# EAGLE design blade design (EAGLE 9.0.0)
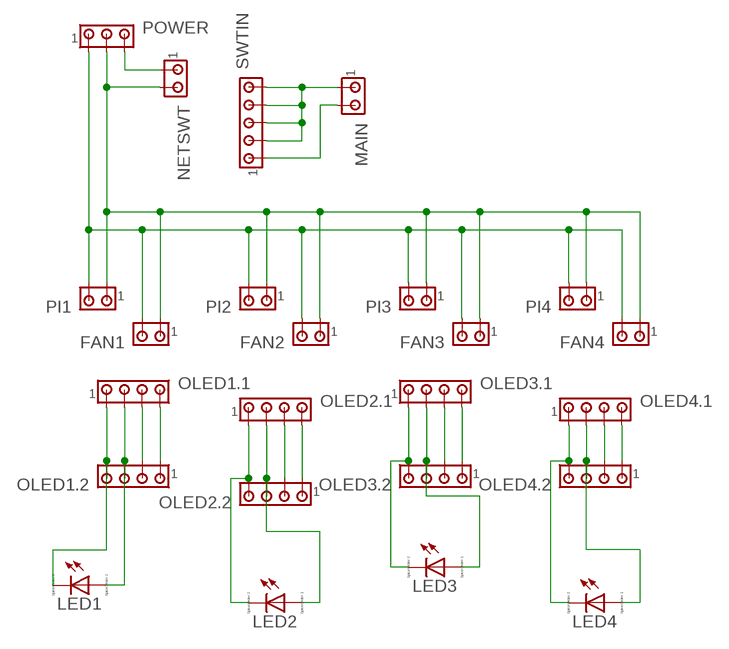
[diagram p0: schematic, sheet 1]

## Parts
FAN1  MTA02-156  [1X2MTA]
FAN2  MTA02-156  [1X2MTA]
FAN3  MTA02-156  [1X2MTA]
FAN4  MTA02-156  [1X2MTA]
LED1  LED_ELD260  [LED_LD260]
LED2  LED_ELD260  [LED_LD260]
LED3  LED_ELD260  [LED_LD260]
LED4  LED_ELD260  [LED_LD260]
MAIN  MTA02-156  [1X2MTA]
NETSWT  MTA02-156  [1X2MTA]
OLED1.1  MTA04-156  [1X4MTA]
OLED1.2  MTA04-156  [1X4MTA]
OLED2.1  MTA04-156  [1X4MTA]
OLED2.2  MTA04-156  [1X4MTA]
OLED3.1  MTA04-156  [1X4MTA]
OLED3.2  MTA04-156  [1X4MTA]
OLED4.1  MTA04-156  [1X4MTA]
OLED4.2  MTA04-156  [1X4MTA]
PI1  MTA02-156  [1X2MTA]
PI2  MTA02-156  [1X2MTA]
PI3  MTA02-156  [1X2MTA]
PI4  MTA02-156  [1X2MTA]
POWER  MTA03-156  [1X3MTA]
SWTIN  MTA05-156  [1X5MTA]

## Nets
3.3V: MAIN.2 SWTIN.1
5V: FAN1.2 FAN2.2 FAN3.2 FAN4.2 PI1.2 PI2.2 PI3.2 PI4.2 POWER.1
12V: NETSWT.1 POWER.3
GND: FAN1.1 FAN2.1 FAN3.1 FAN4.1 NETSWT.2 PI1.1 PI2.1 PI3.1 PI4.1 POWER.2
GND1: LED1.K(C) OLED1.1.1 OLED1.2.4
GND2: LED2.K(C) OLED2.1.1 OLED2.2.4
GND3: LED3.K(C) OLED3.1.1 OLED3.2.4
GND4: LED4.K(C) OLED4.1.1 OLED4.2.4
SCL1: OLED1.1.3 OLED1.2.2
SCL2: OLED2.1.3 OLED2.2.2
SCL3: OLED3.1.3 OLED3.2.2
SCL4: OLED4.1.3 OLED4.2.2
SDA1: OLED1.1.4 OLED1.2.1
SDA2: OLED2.1.4 OLED2.2.1
SDA3: OLED3.1.4 OLED3.2.1
SDA4: OLED4.1.4 OLED4.2.1
SWTCH: MAIN.1 SWTIN.2 SWTIN.3 SWTIN.4 SWTIN.5
VCC1: LED1.A OLED1.1.2 OLED1.2.3
VCC2: LED2.A OLED2.1.2 OLED2.2.3
VCC3: LED3.A OLED3.1.2 OLED3.2.3
VCC4: LED4.A OLED4.1.2 OLED4.2.3

## Library data of the parts
FAN1-FAN4 MAIN NETSWT PI1-PI4 = con-amp:MTA02-156: AMP connector
LED1-LED4 = eagle-ltspice:LED_E: LED Source: http://www.osram.convergy.de Source: www.luxeon.com Source: www.kingbright.com; SPICEMODEL: NONE; SPICEPREFIX: D; SPICETYPE: diode
OLED1.1 OLED1.2 OLED2.1 OLED2.2 OLED3.1 OLED3.2 OLED4.1 OLED4.2 = con-amp:MTA04-156: AMP connector
POWER = con-amp:MTA03-156: AMP connector
SWTIN = con-amp:MTA05-156: AMP connector

## Board
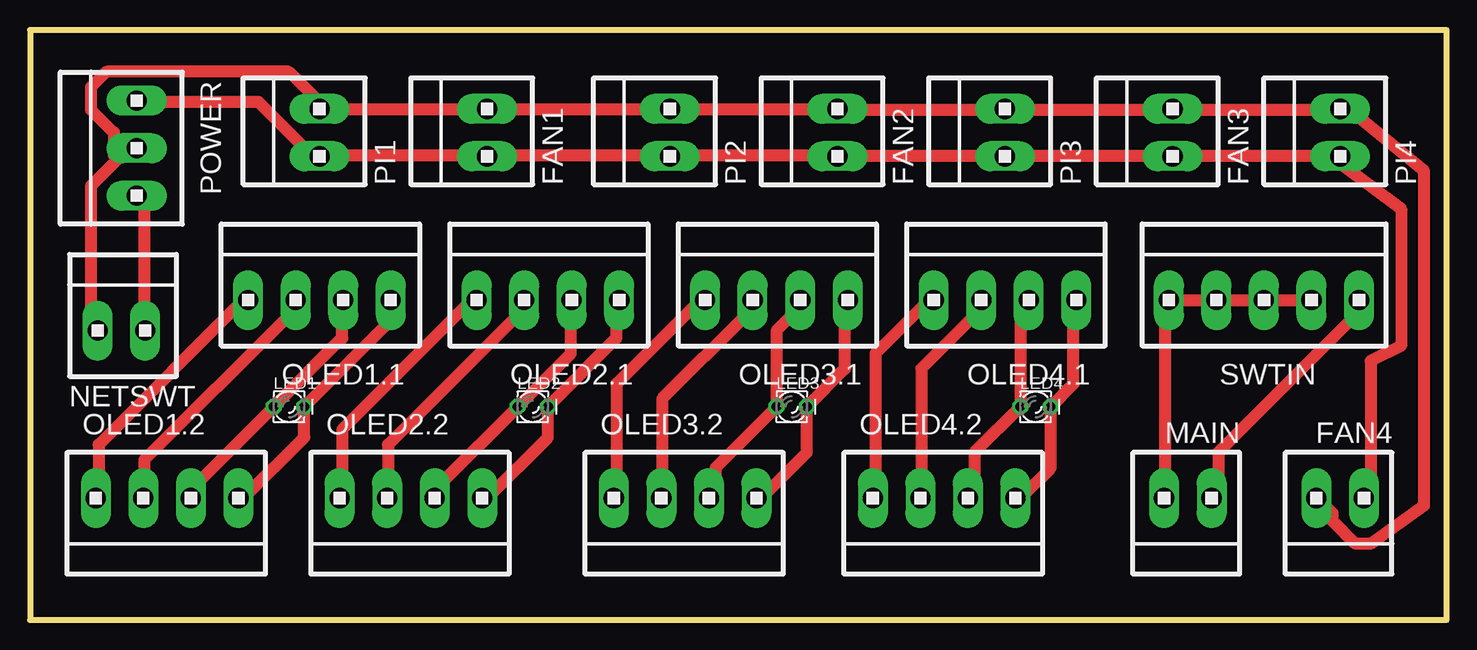
[diagram p1: board, top side]

Size 118.09 x 49.2 mm. Coordinates in mm from the lower left corner, seen from the top.
Outline: 0,0 118.09,0 118.09,49.2 0,49.2 0,0
Copper layers (1*16): Top 0.035mm / dielectric 1.5mm / Bottom 0.035mm
Design rules "default *": minimum track width 40mil, minimum drill 24mm, track to track 16mil, track to pad 16mil, pad to pad 16mil, via to via 16mil, smd to smd 16mil, copper to edge 30mil, drill to drill 8mil, minimum pad ring 10mil, minimum via ring 8mil, stop-mask expansion 4mil, vias tented up to drill 0mil, thermal gap 10mil

### Footprints (pad centres in the part's own frame; a part is rotated, then mirrored left to right if it is on the bottom)
1X2MTA = drill 1.676 long: 1 1.981,0; 2 -1.981,0
LED_LD260 = drill 0.813 octagon: A -1.27,0; K 1.27,0
1X4MTA = drill 1.676 long: 1 5.944,0; 2 1.981,0; 3 -1.981,0; 4 -5.944,0
1X3MTA = drill 1.676 long: 1 3.937,0; 2 -0.025,0; 3 -3.988,0
1X5MTA = drill 1.676 long: 1 7.925,0; 2 3.962,0; 3 0,0; 4 -3.962,0; 5 -7.925,0

### Placement (x,y rotation side)
FAN1  38.1,40.64 90 top
FAN2  67.31,40.64 90 top
FAN3  95.25,40.64 90 top
FAN4  109.22,10.16 180 top
LED1  21.59,17.78 0 top
LED2  41.91,17.78 0 top
LED3  63.5,17.78 0 top
LED4  83.82,17.78 0 top
MAIN  96.52,10.16 180 top
NETSWT  7.62,24.13 0 top
OLED1.1  24.13,26.67 0 top
OLED1.2  11.43,10.16 180 top
OLED2.1  43.18,26.67 0 top
OLED2.2  31.75,10.16 180 top
OLED3.1  62.23,26.67 0 top
OLED3.2  54.61,10.16 180 top
OLED4.1  81.28,26.67 0 top
OLED4.2  76.2,10.16 180 top
PI1  24.13,40.64 90 top
PI2  53.34,40.64 90 top
PI3  81.28,40.64 90 top
PI4  109.22,40.64 90 top
POWER  8.89,39.37 90 top
SWTIN  102.87,26.67 0 top

### Tracks (layer width: path | path; a pad name or v marks a point on that pad's centre or on a via)
3.3V
  Top 1.016: MAIN.2 99.06,10.16 99.06,13.97 110.49,25.4 110.49,26.67 SWTIN.1
5V
  Top 1.016: 38.1,38.73 24.13,38.73 PI1.2 24.13,38.1 19.05,43.18 8.89,43.18 POWER.1 | 67.31,38.73 53.34,38.73 | 67.31,38.73 81.28,38.73 | 67.31,38.73 FAN2.2 | 81.28,38.73 95.25,38.73 | 81.28,38.73 PI3.2 | 95.25,38.73 109.22,38.73 PI4.2 109.22,38.1 114.3,34.29 114.3,22.86 111.76,21.59 111.76,10.16 FAN4.2 | 95.25,38.73 FAN3.2 | 53.34,38.73 38.1,38.73 | 38.1,38.73 FAN1.2 | 53.34,38.73 PI2.2
12V
  Top 1.016: NETSWT.1 9.52,24.13 9.52,34.29 8.89,34.92 POWER.3
GND
  Top 1.016: FAN4.1 107.31,10.16 108.58,8.89 108.58,8.26 110.49,6.35 111.76,6.35 116.2,9.53 116.2,37.47 109.22,43.18 PI4.1 109.22,42.55 95.25,42.55 | NETSWT.2 5.08,24.13 5.08,36.2 7.62,38.73 8.89,38.73 POWER.2 6.99,38.73 6.99,40.64 5.08,42.55 5.08,44.45 6.35,45.72 21.59,45.72 24.13,43.18 PI1.1 24.13,42.55 38.1,42.55 | 67.31,42.55 53.34,42.55 | 67.31,42.55 81.28,42.55 | 67.31,42.55 FAN2.1 | 81.28,42.55 95.25,42.55 | 81.28,42.55 PI3.1 | 53.34,42.55 38.1,42.55 | 38.1,42.55 FAN1.1 | 53.34,42.55 PI2.1 | 95.25,42.55 FAN3.1
GND1
  Top 1.016: OLED1.2.4 17.78,10.16 22.86,15.24 LED1.K 29.84,24.77 29.84,26.67 OLED1.1.1
GND2
  Top 1.016: OLED2.2.4 38.1,10.16 43.18,15.24 LED2.K 48.9,23.5 48.9,26.67 OLED2.1.1
GND3
  Top 1.016: OLED3.2.4 60.96,10.16 64.77,13.97 LED3.K 67.94,20.95 67.94,26.67 OLED3.1.1
GND4
  Top 1.016: OLED4.2.4 82.55,10.16 85.09,12.7 LED4.K 86.99,19.68 86.99,26.67 OLED4.1.1
SCL1
  Top 1.016: OLED1.2.2 9.52,10.16 9.52,13.34 21.59,25.4 21.59,26.67 OLED1.1.3
SCL2
  Top 1.016: OLED2.2.2 29.84,10.16 29.84,14.61 40.64,25.4 40.64,26.67 OLED2.1.3
SCL3
  Top 1.016: OLED3.2.2 52.7,10.16 52.7,18.41 59.69,25.4 59.69,26.67 OLED3.1.3
SCL4
  Top 1.016: OLED4.2.2 74.29,10.16 74.29,20.95 78.74,25.4 78.74,26.67 OLED4.1.3
SDA1
  Top 1.016: OLED1.2.1 5.72,10.16 5.72,14.61 17.78,26.67 OLED1.1.4
SDA2
  Top 1.016: OLED2.2.1 26.04,10.16 26.04,15.88 36.83,26.67 OLED2.1.4
SDA3
  Top 1.016: OLED3.2.1 48.9,10.16 48.9,19.68 55.88,26.67 OLED3.1.4
SDA4
  Top 1.016: OLED4.2.1 70.48,10.16 70.48,22.23 74.93,26.67 OLED4.1.4
SWTCH
  Top 1.016: MAIN.1 94.61,10.16 94.61,26.67 SWTIN.5 SWTIN.4 SWTIN.3 SWTIN.2
VCC1
  Top 1.016: OLED1.2.3 13.97,10.16 13.97,11.43 LED1.A 26.04,23.5 26.04,26.67 OLED1.1.2
VCC2
  Top 1.016: OLED2.2.3 34.29,10.16 34.29,11.43 LED2.A 45.09,22.23 45.09,26.67 OLED2.1.2
VCC3
  Top 1.016: OLED3.1.2 64.77,26.67 62.23,24.13 LED3.A 57.15,12.7 57.15,10.16 OLED3.2.3
VCC4
  Top 1.016: OLED4.1.2 83.18,26.67 82.55,26.04 LED4.A 78.74,13.97 78.74,10.16 OLED4.2.3